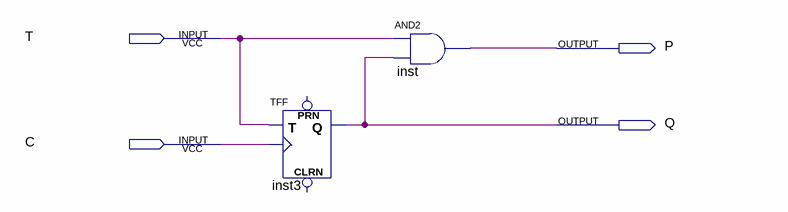
[diagram p0: schematic sheet]
// Quartus schematic Elblock.bdf as structural Verilog: 2 symbols, 4 pins
module Elblock (
  input  T,
  input  C,
  output P,
  output Q
);

  TFF inst3 (.T(T), .CLK(C), .Q(Q));  // open: PRN, CLRN
  and inst (P, T, Q);
endmodule
